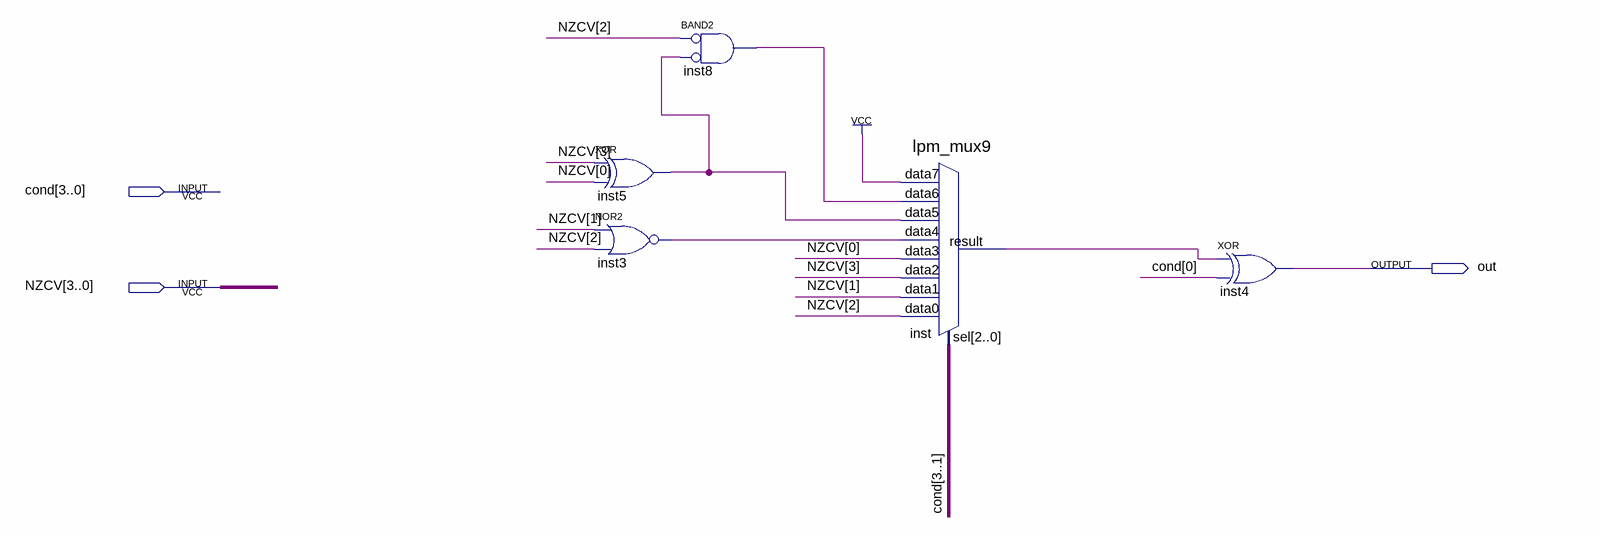
[diagram p0: schematic sheet]
// Quartus schematic Hold.bdf as structural Verilog: 5 symbols, 3 pins
module Hold (
  input  [3:0] cond,
  input  [3:0] NZCV,
  output out
);

  wire inst3_out, inst5_out, inst8_out, inst_result;

  xor inst5 (inst5_out, NZCV[3], NZCV[0]);
  nor inst3 (inst3_out, NZCV[1], NZCV[2]);
  and inst8 (inst8_out, ~NZCV[2], ~inst5_out);  // BAND2
  lpm_mux9 inst (
    .data7(1'b1), .data6(inst8_out), .data5(inst5_out), .data4(inst3_out), .data3(NZCV[0]), .data2(NZCV[3]),
    .data1(NZCV[1]), .data0(NZCV[2]), .sel(cond[3:1]), .result(inst_result));
  xor inst4 (out, inst_result, cond[0]);
endmodule
